# EAGLE schematic Codeshelf-0008.v01 (EAGLE 6.5.0)
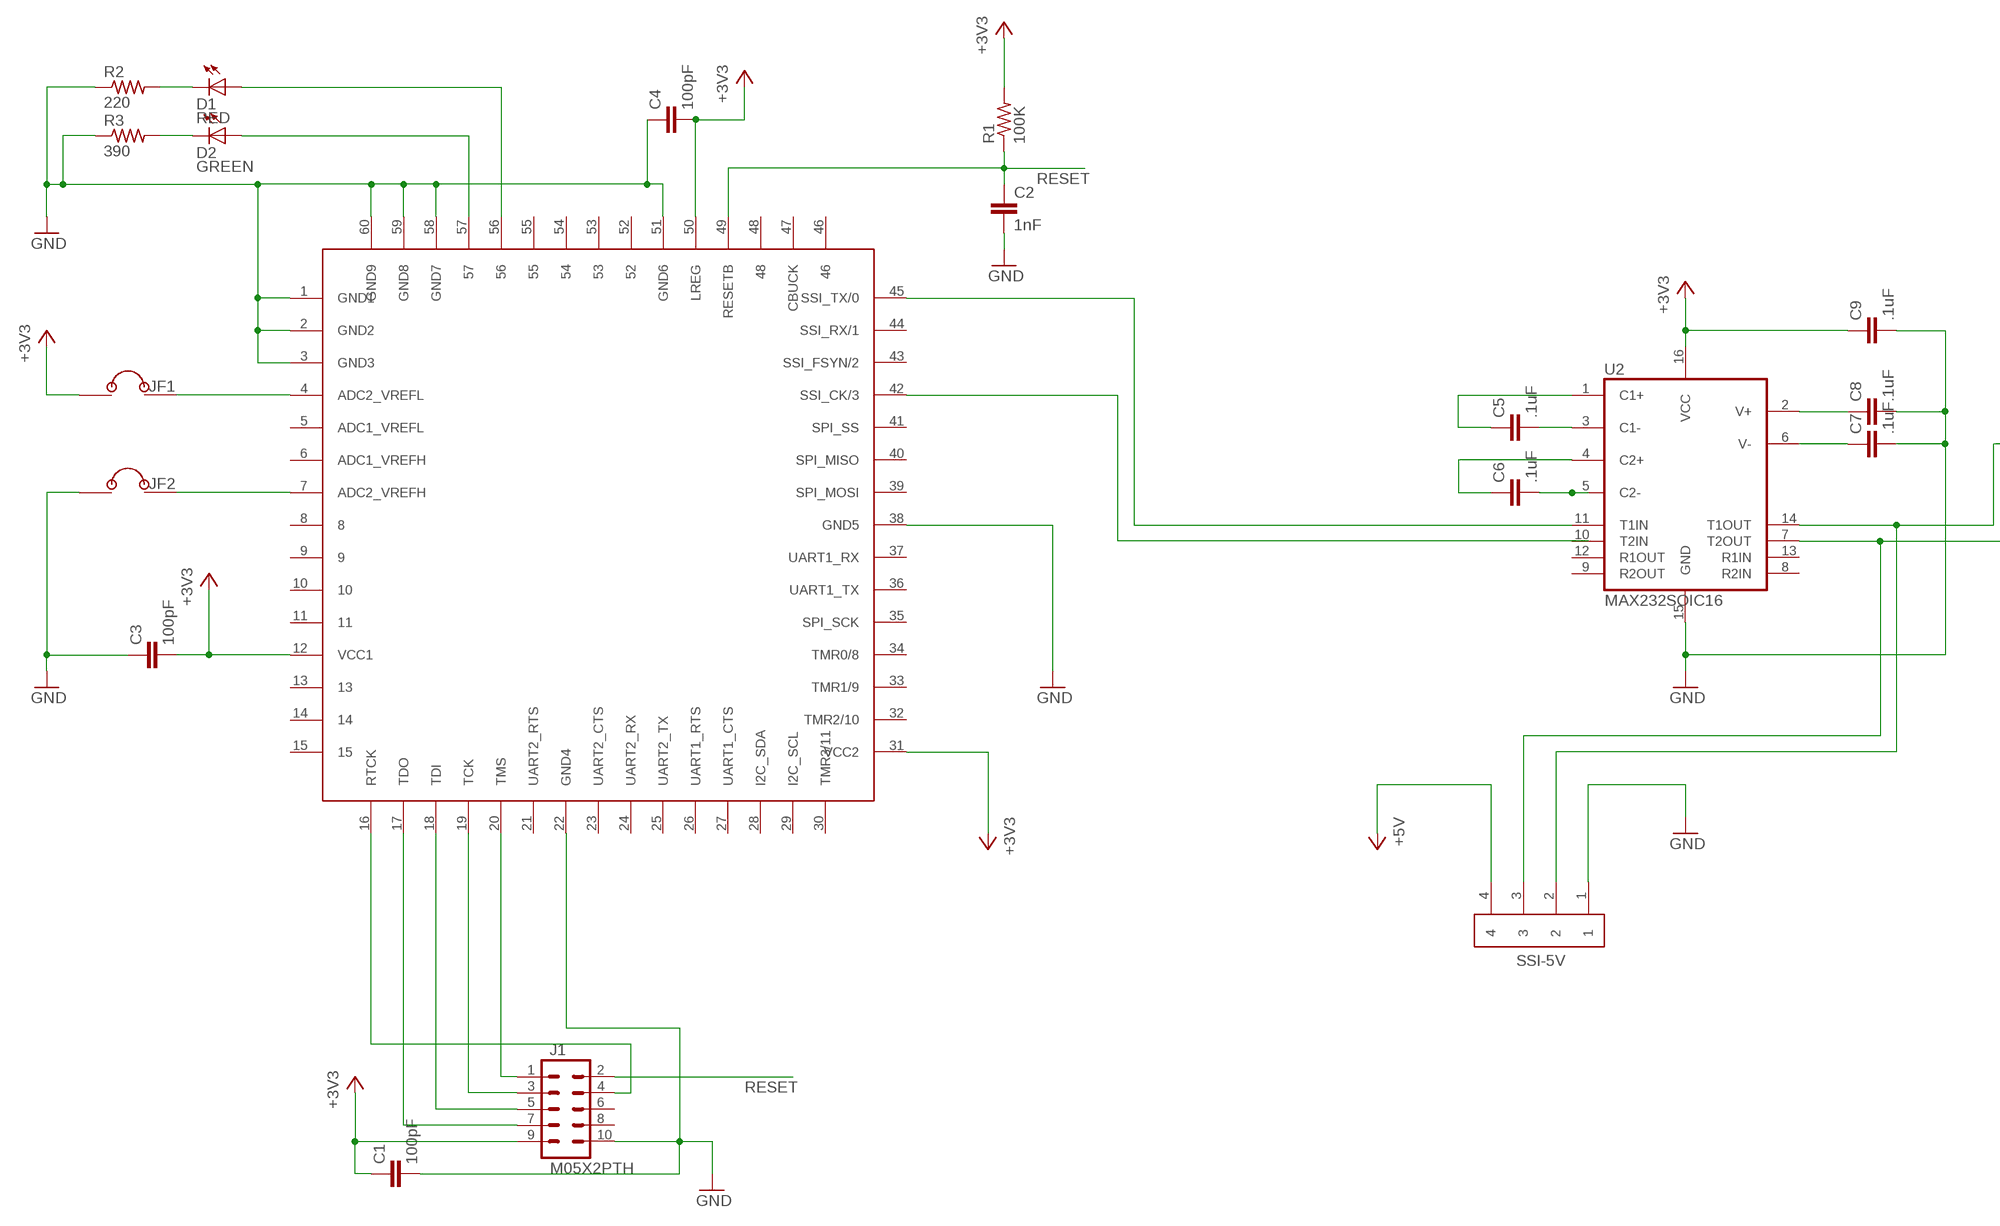
[diagram p0: schematic, sheet 1, part 1 of 2]
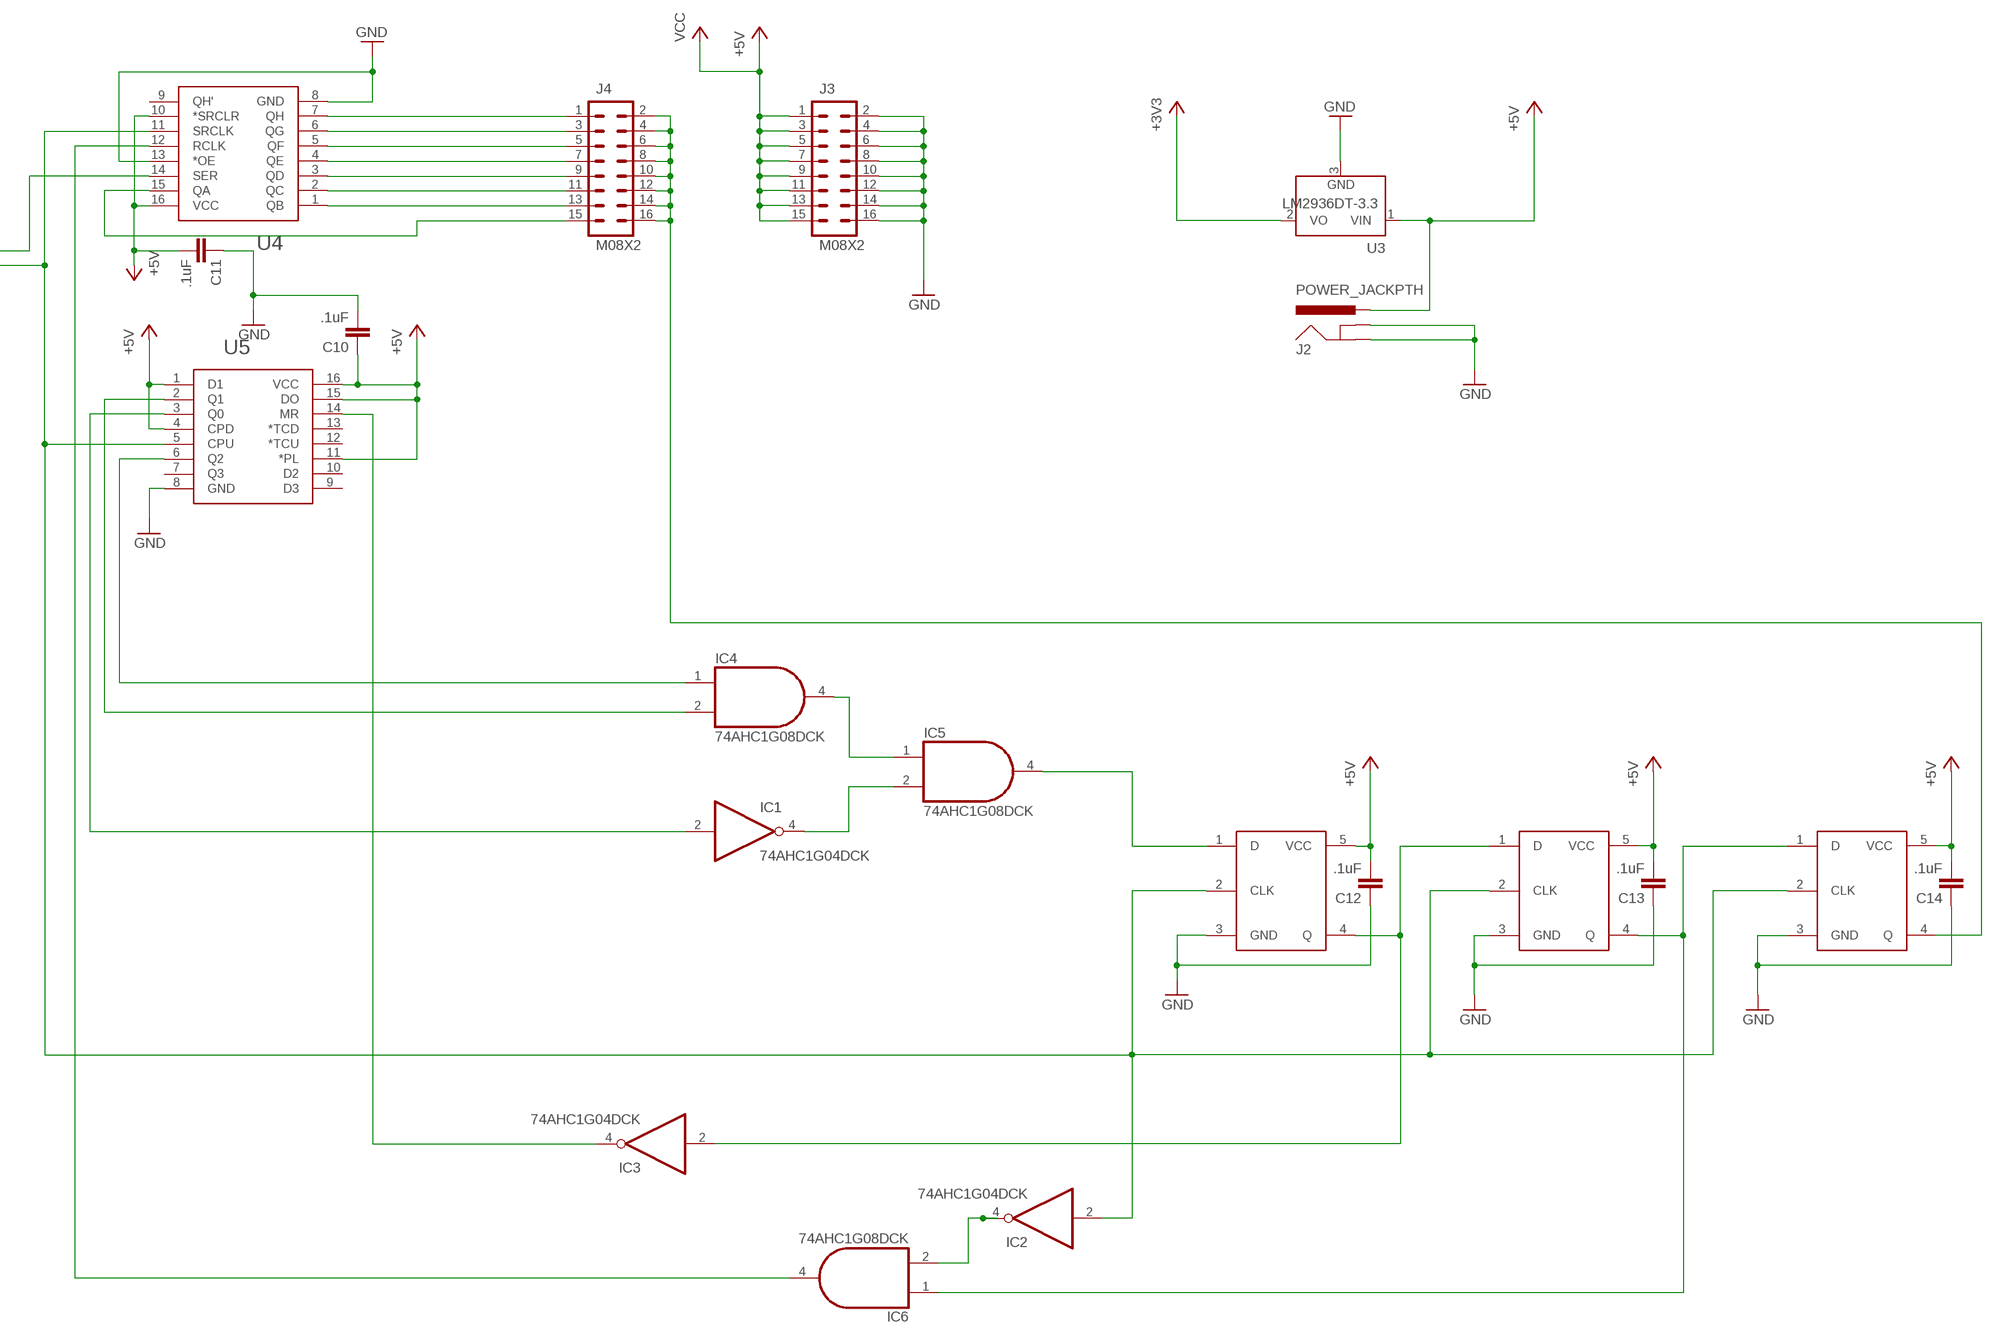
[diagram p1: schematic, sheet 1, part 2 of 2]

## Parts
C1  100pF  RF-C0603  [C0603]
C2  1nF  RF-C0603  [C0603]
C3  100pF  RF-C0603  [C0603]
C4  100pF  RF-C0603  [C0603]
C5  .1uF  RF-C0402  [C0402]
C6  .1uF  RF-C0402  [C0402]
C7  .1uF  RF-C0402  [C0402]
C8  .1uF  RF-C0402  [C0402]
C9  .1uF  RF-C0402  [C0402]
C10  .1uF  RF-C0402  [C0402]
C11  .1uF  RF-C0402  [C0402]
C12  .1uF  RF-C0402  [C0402]
C13  .1uF  RF-C0402  [C0402]
C14  .1uF  RF-C0402  [C0402]
D1  RED  LEDCHIP-LED0805  [CHIP-LED0805]
D2  GREEN  LEDCHIP-LED0805  [CHIP-LED0805]
IC1  74AHC1G04DCK  [SC70-5]
IC2  74AHC1G04DCK  [SC70-5]
IC3  74AHC1G04DCK  [SC70-5]
IC4  74AHC1G08DCK  [SC70-5]
IC5  74AHC1G08DCK  [SC70-5]
IC6  74AHC1G08DCK  [SC70-5]
J1  M05X2PTH  [AVR_ICSP]
J2  POWER_JACKPTH  [POWER_JACK_PTH]
J3  M08X2  [2X8]
J4  M08X2  [2X8]
JF1  JUMPER-2X-SMT-VIA  [JUMPER-VIA-2X]
JF2  JUMPER-2X-SMT-VIA  [JUMPER-VIA-2X]
R1  100K  RF-R0402  [RF-R0402]
R2  220  RF-R0402  [RF-R0402]
R3  390  RF-R0402  [RF-R0402]
SSI-5V  HEADER-4X39357  [MOLEX-39357-0004]
U1  ZSFM201-1A  [ZSFM201-1]
U2  MAX232SOIC16  [SO016]
U3  LM2936DT-3.3  [TO252]
U4  SN74HC595PW  [TSSOP16]
U5  74HCT193PW  [TSSOP16]
U6  D-FLIP-FLOP-74LV1G79  [SOT353]
U7  D-FLIP-FLOP-74LV1G79  [SOT353]
U8  D-FLIP-FLOP-74LV1G79  [SOT353]

## Nets
+3V3 [3v3]: C1.1 C3.2 C4.2 C9.1 J1.9 JF1.1 R1.2 U1.12(VCC1) U1.31(VCC2) U1.50(LREG) U2.16(VCC) U3.2(VO)
+5V [5V]: C10.1 C11.2 C12.2 C13.2 C14.2 J2.PWR J3.1 J3.3 J3.5 J3.7 J3.9 J3.11 J3.13 J3.15 SSI-5V.4 U3.1(VIN) U4.10(*SRCLR) U4.16(VCC) U5.1(D1) U5.4(CPD) U5.11(*PL) U5.15(DO) U5.16(VCC) U6.5(VCC) U7.5(VCC) U8.5(VCC) ; supply symbol labelled VCC
C1: C5.1 U2.1(C1+)
C2: C6.1 U2.4(C2+)
GND [GND]: C1.2 C2.2 C3.1 C4.1 C7.2 C8.2 C9.2 C10.2 C11.1 C12.1 C13.1 C14.1 J1.10 J2.GND J2.GNDBREAK J3.2 J3.4 J3.6 J3.8 J3.10 J3.12 J3.14 J3.16 JF2.1 R2.1 R3.1 SSI-5V.1 U1.1(GND1) U1.2(GND2) U1.3(GND3) U1.22(GND4) U1.38(GND5) U1.51(GND6) U1.58(GND7) U1.59(GND8) U1.60(GND9) U2.15(GND) U3.3(GND) U4.8(GND) U4.13(*OE) U5.8(GND) U6.3(GND) U7.3(GND) U8.3(GND)
N$1: D2.A U1.57
N$2: D1.A U1.56
N$3: D2.C R3.2
N$4: D1.C R2.2
N$6: JF2.2 U1.7(ADC2_VREFH)
N$7: JF1.2 U1.4(ADC2_VREFL)
N$8: C5.2 U2.3(C1-)
N$10: J4.13 U4.1(QB)
N$11: C6.2 U2.5(C2-)
N$12: C7.1 U2.6(V-)
N$13: J4.11 U4.2(QC)
N$14: J4.9 U4.3(QD)
N$15: C8.1 U2.2(V+)
N$16: J4.7 U4.4(QE)
N$17: J4.5 U4.5(QF)
N$18: J4.3 U4.6(QG)
N$19: J4.1 U4.7(QH)
N$20: J4.15 U4.15(QA)
N$22: IC1.4(O) IC5.2(I1)
N$23: IC4.4(O) IC5.1(I0)
N$24: IC5.4(O) U6.1(D)
N$25: IC3.2(I) U6.4(Q) U7.1(D)
N$26: IC6.1(I0) U7.4(Q) U8.1(D)
N$28: IC2.4(O) IC6.2(I1)
N$29: IC1.2(I) U5.3(Q0)
N$30: IC4.2(I1) U5.2(Q1)
N$31: IC4.1(I0) U5.6(Q2)
N$32: IC3.4(O) U5.14(MR)
N$33: IC6.4(O) U4.12(RCLK)
RESET: C2.1 J1.2 R1.1 U1.49(RESETB)
RTCK: J1.4 U1.16(RTCK)
SSI-CLK: J4.2 J4.4 J4.6 J4.8 J4.10 J4.12 J4.14 J4.16 U8.4(Q)
SSI-CLK-3V3: U1.42(SSI_CK/3)
SSI-CLK-5V: IC2.2(I) SSI-5V.3 U2.7(T2OUT) U4.11(SRCLK) U5.5(CPU) U6.2(CLK) U7.2(CLK) U8.2(CLK)
SSI-TX-3V3: U1.45(SSI_TX/0) U2.11(T1IN)
SSI-TX-5V: SSI-5V.2 U2.14(T1OUT) U4.14(SER)
TCK: J1.3 U1.19(TCK)
TDI: J1.5 U1.18(TDI)
TDO: J1.7 U1.17(TDO)
TMS: J1.1 U1.20(TMS)
Unconnected: J1.6 J1.8 U1.5(ADC1_VREFL) U1.6(ADC1_VREFH) U1.8 U1.9 U1.10 U1.11 U1.13 U1.14 U1.15 U1.21(UART2_RTS) U1.23(UART2_CTS) U1.24(UART2_RX) U1.25(UART2_TX) U1.26(UART1_RTS) U1.27(UART1_CTS) U1.28(I2C_SDA) U1.29(I2C_SCL) U1.30(TMR3/11) U1.32(TMR2/10) U1.33(TMR1/9) U1.34(TMR0/8) U1.35(SPI_SCK) U1.36(UART1_TX) U1.37(UART1_RX) U1.39(SPI_MOSI) U1.40(SPI_MISO) U1.41(SPI_SS) U1.43(SSI_FSYN/2) U1.44(SSI_RX/1) U1.46 U1.47(CBUCK) U1.48 U1.52 U1.53 U1.54 U1.55 U2.8(R2IN) U2.9(R2OUT) U2.10(T2IN) U2.12(R1OUT) U2.13(R1IN) U4.9(QH') U5.7(Q3) U5.9(D3) U5.10(D2) U5.12(*TCU) U5.13(*TCD)

## Power pins joined to a net without a drawn wire
GND: IC1.3(GND) IC2.3(GND) IC3.3(GND) IC4.3(GND) IC5.3(GND) IC6.3(GND)
VCC: IC1.5(VCC) IC2.5(VCC) IC3.5(VCC) IC4.5(VCC) IC5.5(VCC) IC6.5(VCC)

## Library data of the parts
C1 C3 C4 = GW-devices:RF-C: RF capacitor pads for FSL reference design; MFGN: Murata; MFGP: C0603C101K5RACTU
C2 = GW-devices:RF-C: RF capacitor pads for FSL reference design; MFGN: Murata; MFGP: C0603C102K4RACTU
C5-C14 = GW-devices:RF-C: RF capacitor pads for FSL reference design; MFGN: Murata; MFGP: GRM155R61C104KA88D; PRICE: 0.03
D1 = led:LED: LED OSRAM: - CHIPLED LG R971, LG N971, LY N971, LG Q971, LY Q971, LO R971, LY R971 LH N974, LH R974 LS Q976, LO Q976, LY Q976 LO Q996 - Hyper CHIPLED LW Q18S LB Q993, LB Q99A, LB R99A - SideLED LS A670, LO A670, LY A670, LG A670, LP A670 LB A673, LV A673, LT A673, LW A673 LH A674 LY A675 LS A676, LA A676, LO A676, LY A676, LW A676 LS A679, LY A679, LG A679 - Hyper Micro SIDELED® LS Y876, LA Y876, LO Y876, LY Y876 LT Y87S - SmartLED LW L88C, LW L88S LB L89C, LB L89S, LG L890 LS L89K, LO L89K, LY L89K LS L896, LA L896, LO L896, LY L896 - TOPLED LS T670, LO T670, LY T670, LG T670, LP T670 LSG T670, LSP T670, LSY T670, LOP T670, LYG T670 LG T671, LOG T671, LSG T671 LB T673, LV T673, LT T673, LW T673 LH T674 LS T676, LA T676, LO T676, LY T676, LB T676, LH T676, LSB T676, LW T676 LB T67C, LV T67C, LT T67C, LS T67K, LO T67K, LY T67K, LW E67C LS E67B, LA E67B, LO E67B, LY E67B, LB E67C, LV E67C, LT E67C LW T67C LS T679, LY T679, LG T679 LS T770, LO T770, LY T770, LG T770, LP T770 LB T773, LV T773, LT T773, LW T773 LH T774 LS E675, LA E675, LY E675, LS T675 LS T776, LA T776, LO T776, LY T776, LB T776 LHGB T686 LT T68C, LB T68C - Hyper Mini TOPLED® LB M676 - Mini TOPLED Santana® LG M470 LS M47K, LO M47K, LY M47K Source: http://www.osram.convergy.de LUXEON: - LUMILED® LXK2-PW12-R00, LXK2-PW12-S00, LXK2-PW14-U00, LXK2-PW14-V00 LXK2-PM12-R00, LXK2-PM12-S00, LXK2-PM14-U00 LXK2-PE12-Q00, LXK2-PE12-R00, LXK2-PE12-S00, LXK2-PE14-T00, LXK2-PE14-U00 LXK2-PB12-K00, LXK2-PB12-L00, LXK2-PB12-M00, LXK2-PB14-N00, LXK2-PB14-P00, LXK2-PB14-Q00 LXK2-PR12-L00, LXK2-PR12-M00, LXK2-PR14-Q00, LXK2-PR14-R00 LXK2-PD12-Q00, LXK2-PD12-R00, LXK2-PD12-S00 LXK2-PH12-R00, LXK2-PH12-S00 LXK2-PL12-P00, LXK2-PL12-Q00, LXK2-PL12-R00 Source: www.luxeon.com KINGBRIGHT: KA-3528ASYC Source: www.kingbright.com; MFGN: OSRAM; MFGP: Q62702P5182; NOTES: DNP
D2 = led:LED: LED OSRAM: - CHIPLED LG R971, LG N971, LY N971, LG Q971, LY Q971, LO R971, LY R971 LH N974, LH R974 LS Q976, LO Q976, LY Q976 LO Q996 - Hyper CHIPLED LW Q18S LB Q993, LB Q99A, LB R99A - SideLED LS A670, LO A670, LY A670, LG A670, LP A670 LB A673, LV A673, LT A673, LW A673 LH A674 LY A675 LS A676, LA A676, LO A676, LY A676, LW A676 LS A679, LY A679, LG A679 - Hyper Micro SIDELED® LS Y876, LA Y876, LO Y876, LY Y876 LT Y87S - SmartLED LW L88C, LW L88S LB L89C, LB L89S, LG L890 LS L89K, LO L89K, LY L89K LS L896, LA L896, LO L896, LY L896 - TOPLED LS T670, LO T670, LY T670, LG T670, LP T670 LSG T670, LSP T670, LSY T670, LOP T670, LYG T670 LG T671, LOG T671, LSG T671 LB T673, LV T673, LT T673, LW T673 LH T674 LS T676, LA T676, LO T676, LY T676, LB T676, LH T676, LSB T676, LW T676 LB T67C, LV T67C, LT T67C, LS T67K, LO T67K, LY T67K, LW E67C LS E67B, LA E67B, LO E67B, LY E67B, LB E67C, LV E67C, LT E67C LW T67C LS T679, LY T679, LG T679 LS T770, LO T770, LY T770, LG T770, LP T770 LB T773, LV T773, LT T773, LW T773 LH T774 LS E675, LA E675, LY E675, LS T675 LS T776, LA T776, LO T776, LY T776, LB T776 LHGB T686 LT T68C, LB T68C - Hyper Mini TOPLED® LB M676 - Mini TOPLED Santana® LG M470 LS M47K, LO M47K, LY M47K Source: http://www.osram.convergy.de LUXEON: - LUMILED® LXK2-PW12-R00, LXK2-PW12-S00, LXK2-PW14-U00, LXK2-PW14-V00 LXK2-PM12-R00, LXK2-PM12-S00, LXK2-PM14-U00 LXK2-PE12-Q00, LXK2-PE12-R00, LXK2-PE12-S00, LXK2-PE14-T00, LXK2-PE14-U00 LXK2-PB12-K00, LXK2-PB12-L00, LXK2-PB12-M00, LXK2-PB14-N00, LXK2-PB14-P00, LXK2-PB14-Q00 LXK2-PR12-L00, LXK2-PR12-M00, LXK2-PR14-Q00, LXK2-PR14-R00 LXK2-PD12-Q00, LXK2-PD12-R00, LXK2-PD12-S00 LXK2-PH12-R00, LXK2-PH12-S00 LXK2-PL12-P00, LXK2-PL12-Q00, LXK2-PL12-R00 Source: www.luxeon.com KINGBRIGHT: KA-3528ASYC Source: www.kingbright.com; MFGN: OSRAM; MFGP: Q65110P5179; NOTES: DNP
IC1-IC3 = 74xx-little-us:74*1G04: INVERTER Gate; MFGN: NXP; MFGP: 74LVC1GU04GW; PRICE: 0.25
IC4-IC6 = 74xx-little-us:74*1G08: 2-input AND gate; MFGN: Diodes, Inc; MFGP: 74LVC1G08SE; PRICE: 0.38
J1 = SparkFun:M05X2: Header 5x2 Standard 10-pin dual row 0.1" header. Commonly used with AVR-ISP. Use with Spark Fun Electronics SKU: PRT-00778
J2 = GW-devices:POWER_JACK: Power Jack This is the standard 5.5mm barrel jack for power. The PTH is the most common, proven, reliable, footprint. All others are experimental. The Slot footprint only works if the mill layer is transmitted to the PCB fab house so be warned. Spark Fun Electronics SKU : PRT-00119. Mating wall wart : TOL-00298 (and others); MFG: Kobiconn; MFGP: 163-7620-E
J3 J4 = SparkFun:M08X2
JF1 JF2 = GW-devices:JUMPER-2X: This kind of jumper provides a place to place to put "green wires" for jumpering fetaure/options.
R1 = GW-devices:RF-R: RF resistor pads for FSL reference design; MFGN: Panasonic; MFGP: ERJ-2GEJ104X
R2 = GW-devices:RF-R: RF resistor pads for FSL reference design; MFGN: Panasonic; MFGP: ERJ-2GEJ224X; NOTES: DNP
R3 = GW-devices:RF-R: RF resistor pads for FSL reference design; MFGN: Panasonic; MFGP: ERJ-2GEJ394X; NOTES: DNP
SSI-5V = GW-devices:HEADER-4X: 4 position pin header; MFGN: Molex; MFGP: 39357-0004; PRICE: 1.00
U1 = GW-devices:ZSFM201-1: The CEL MC13224V; MFGN: CEL; MFGP: ZFSM-201-1C; PRICE: 29.00
U2 = SparkFun:MAX232: RS232 Transceiver Very common IC. This is generically called 'MAX232', but works with the 3V equivalent MAX3232 generic ICs. Field tested and mother approved. Spark Fun Electronics SKU : COM-00316 (DIP) and COM-00589 (SMD); MFGN: TI; MFGP: MAX232DR; PRICE: 0.86
U3 = national-semiconductor:LM2936?*: Ultra-Low Quiescent Current LDO Voltage Regulator Source: Data sheet <http://www.national.com/ds/LM/LM2936.pdf>; MFGN: STM Electronics; MFGP: L4931ABDT33-TR; MPN: LM2936DT-3.3.; OC_FARNELL: 1286863; OC_NEWARK: 26M0361; PRICE: 1.00
U4 = GW-devices:SN74HC595PW; MFGN: TI; MFGP: SN74HC595PWR; PRICE: 0.31
U5 = GW-devices:74HCT193PW; MFGN: NXP; MFGP: 74HCT193PW; PRICE: 0.60
U6-U8 = GW-devices:D-FLIP-FLOP; MFGN: TI; MFGP: SN74LVC1G79DBVR; PRICE: 0.27

## Net classes
1 3v3: width 0.5 mm
2 5V: width 0.4 mm
4 GND: width 0.5 mm
5 RS485: width 0.4 mm